# EAGLE design cm_ltc6102 (EAGLE 8.3.0)

## Sheet 1 of 2
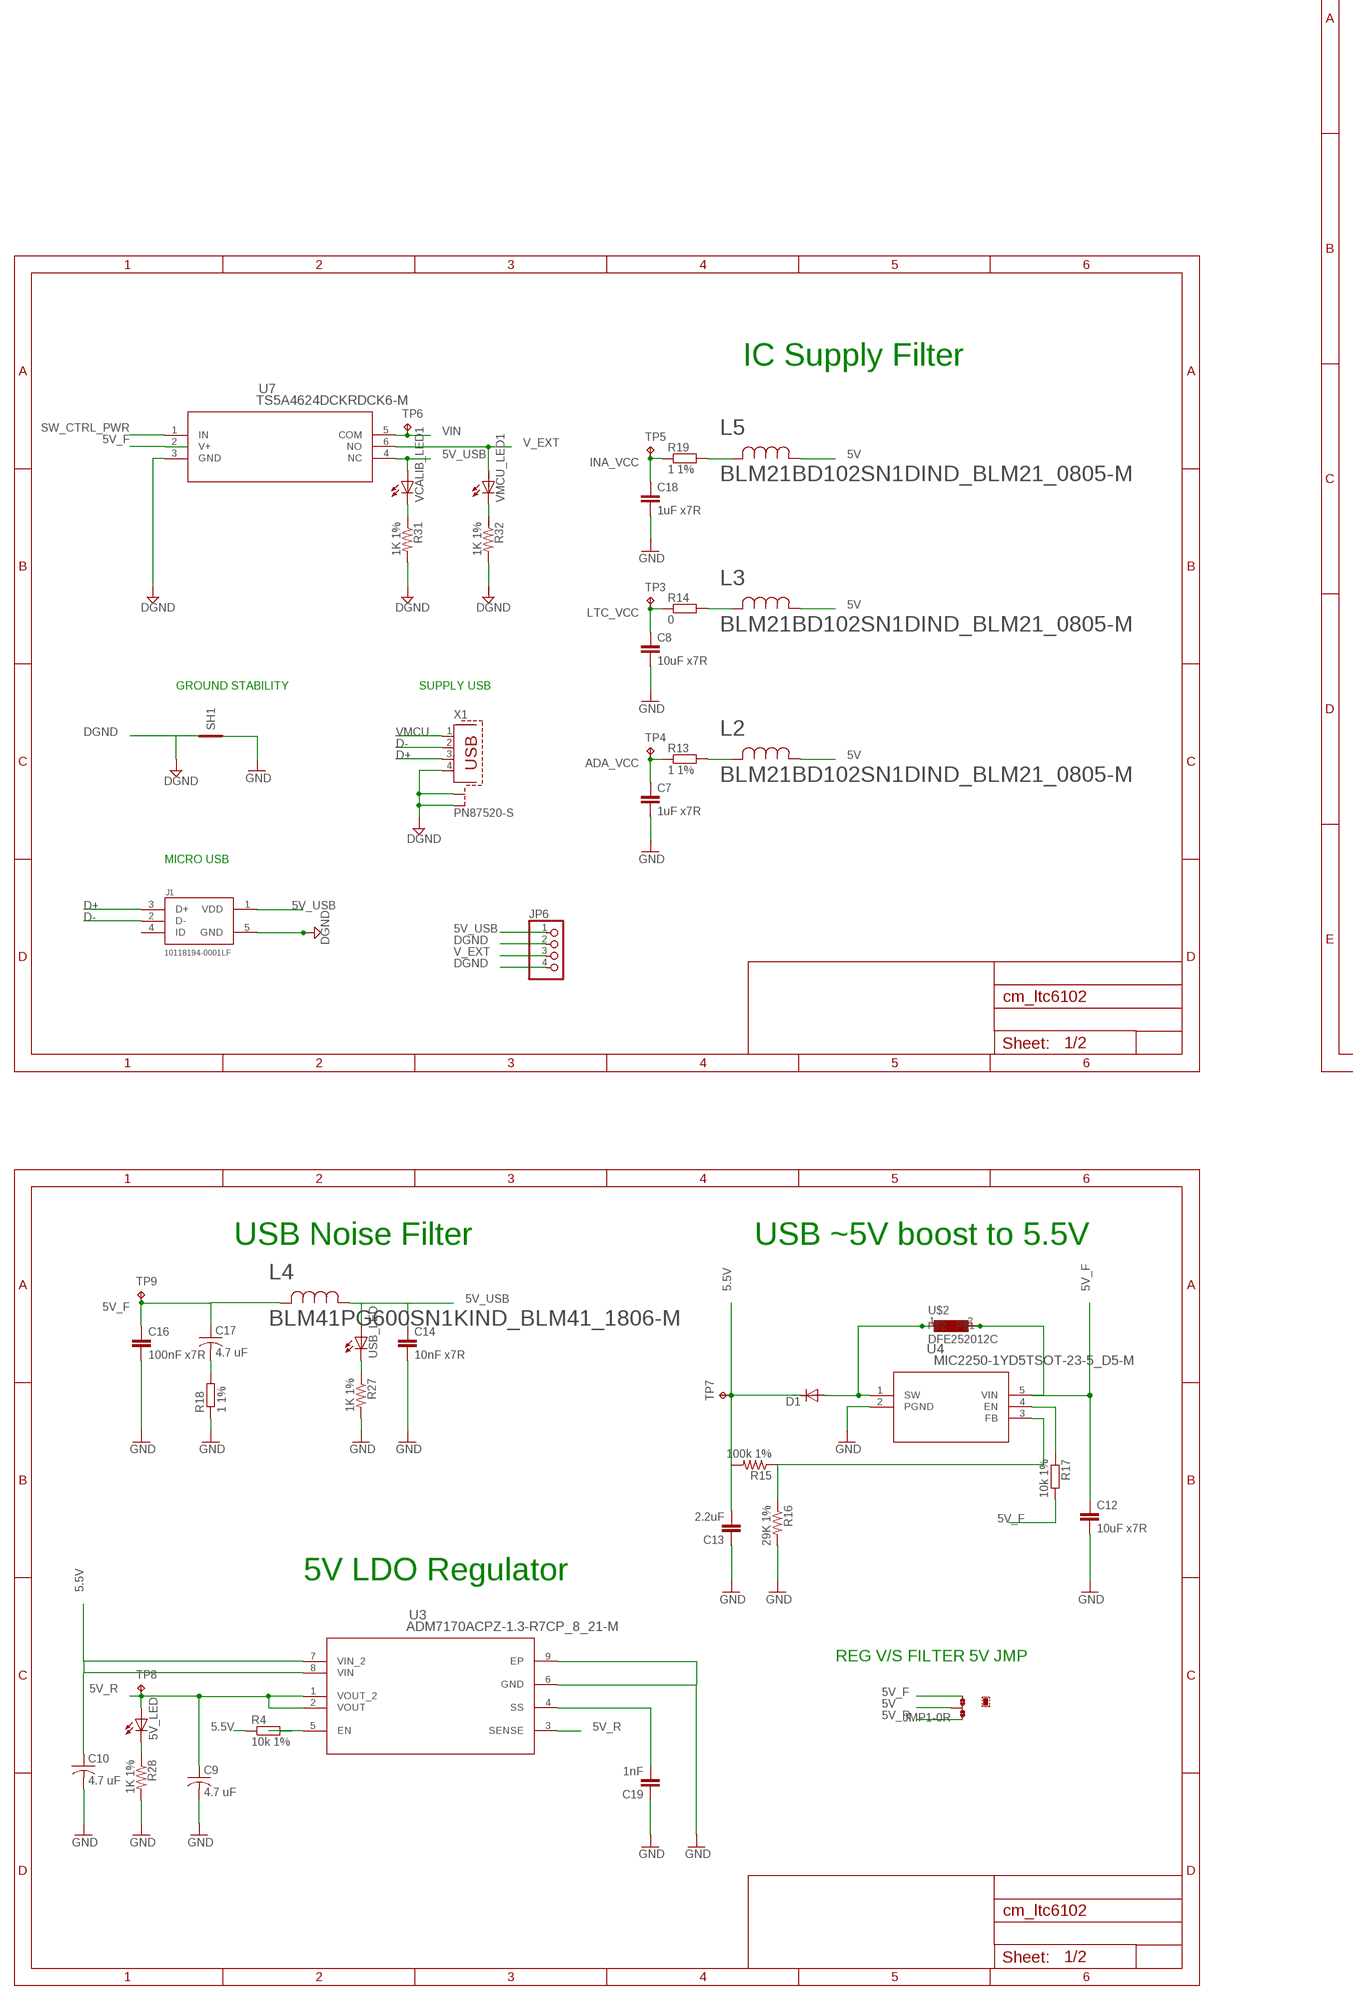
[diagram p0: schematic, sheet 1, part 1 of 2]
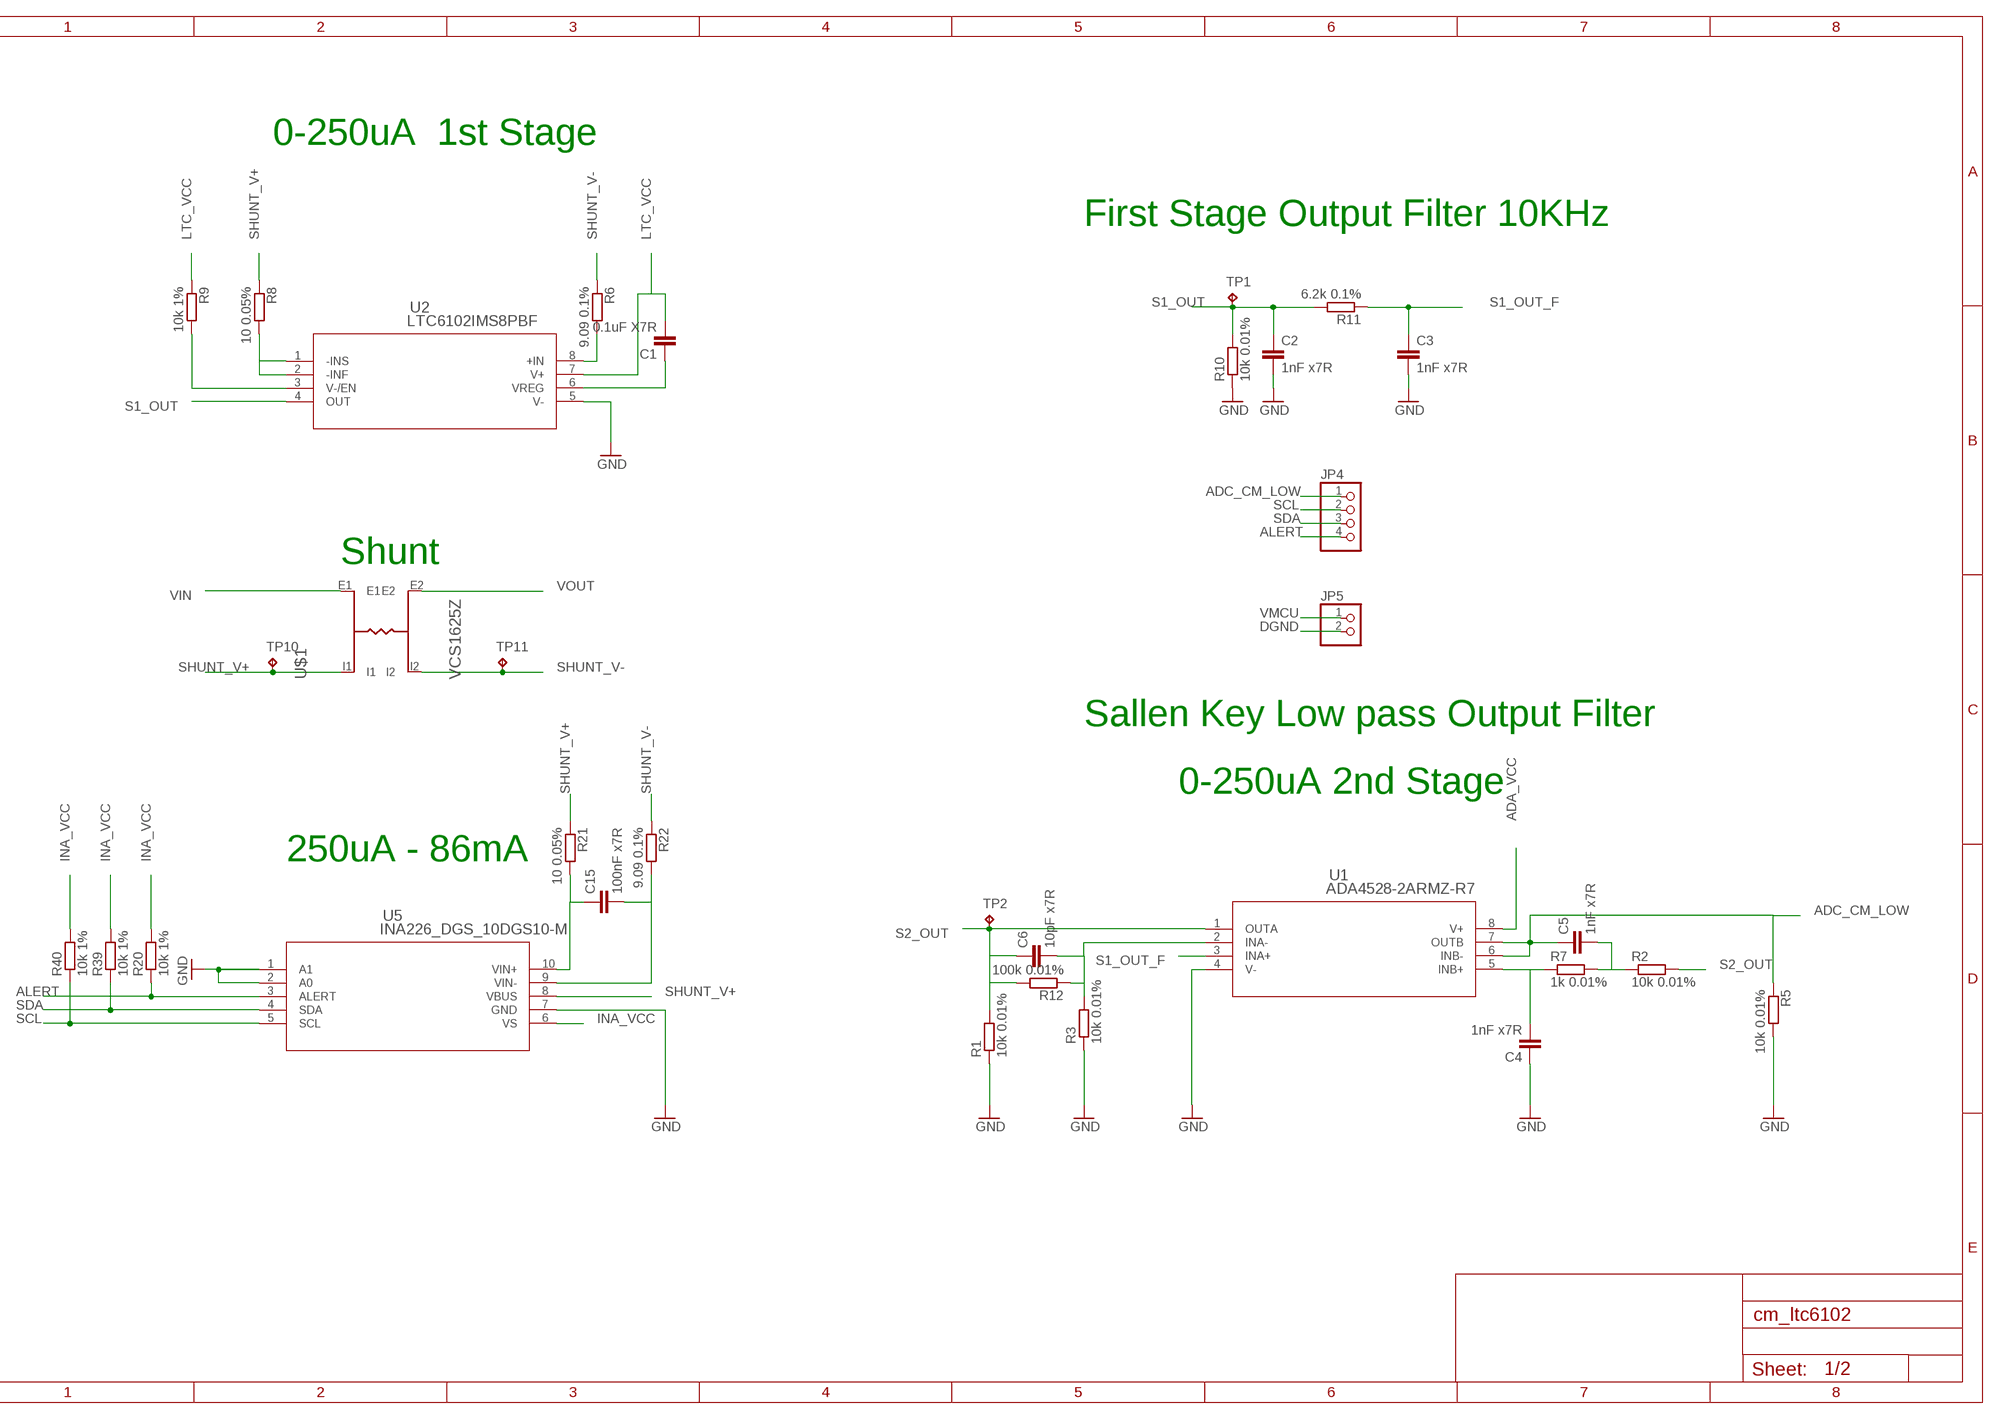
[diagram p1: schematic, sheet 1, part 2 of 2]

### Parts
5V_LED  LEDCHIPLED_0603  [CHIPLED_0603]
C1  0.1uF X7R  C-EUC0805  [C0805]
C2  1nF x7R  C-EUC0603  [C0603]
C3  1nF x7R  C-EUC0603  [C0603]
C4  1nF x7R  C-EUC0603  [C0603]
C5  1nF x7R  C-EUC0603  [C0603]
C6  10pF x7R  C-EUC0603  [C0603]
C7  1uF x7R  C-EUC0603  [C0603]
C8  10uF x7R  C-EUC0603  [C0603]
C9  4.7 uF  C-USC1206  [C1206]
C10  4.7 uF  C-USC1206  [C1206]
C12  10uF x7R  C-EUC0603  [C0603]
C13  2.2uF  C-EUC0603  [C0603]
C14  10nF x7R  C-EUC0603  [C0603]
C15  100nF x7R  C-EUC0603  [C0603]
C16  100nF x7R  C-EUC0603  [C0603]
C17  4.7 uF  C-USC1206  [C1206]
C18  1uF x7R  C-EUC0603  [C0603]
C19  1nF  C-EUC0603  [C0603]
D1  DIODE-SOD80C  [SOD80C]
J1  10118194-0001LF  [FRAMATOME_10118194-0001LF]
JMP1  0R-JUMPA  [A0R-JMP]
JP4  PINHD-1X4  [1X04]
JP5  PINHD-1X2  [1X02]
JP6  PINHD-1X4  [1X04]
L2  BLM21BD102SN1DIND_BLM21_0805-M  [IND_BLM21_0805-M]
L3  BLM21BD102SN1DIND_BLM21_0805-M  [IND_BLM21_0805-M]
L4  BLM41PG600SN1KIND_BLM41_1806-M  [IND_BLM41_1806-M]
L5  BLM21BD102SN1DIND_BLM21_0805-M  [IND_BLM21_0805-M]
R1  10k 0.01%  R-EU_R0603  [R0603]
R2  10k 0.01%  R-EU_R0603  [R0603]
R3  10k 0.01%  R-EU_R0603  [R0603]
R4  10k 1%  R-EU_R0603  [R0603]
R5  10k 0.01%  R-EU_R0603  [R0603]
R6  9.09 0.1%  R-EU_R0603  [R0603]
R7  1k 0.01%  R-EU_R0805  [R0805]
R8  10 0.05%  R-EU_R0603  [R0603]
R9  10k 1%  R-EU_R0603  [R0603]
R10  10k 0.01%  R-EU_R0603  [R0603]
R11  6.2k 0.1%  R-EU_R0603  [R0603]
R12  100k 0.01%  R-EU_R0603  [R0603]
R13  1 1%  R-EU_R0603  [R0603]
R14  0  R-EU_R0603  [R0603]
R15  100k 1%  R-US_R0603  [R0603]
R16  29K 1%  R-US_R0603  [R0603]
R17  10k 1%  R-EU_R0603  [R0603]
R18  1 1%  R-EU_R0603  [R0603]
R19  1 1%  R-EU_R0603  [R0603]
R20  10k 1%  R-EU_R0603  [R0603]
R21  10 0.05%  R-EU_R0603  [R0603]
R22  9.09 0.1%  R-EU_R0603  [R0603]
R27  1K 1%  R-US_R0603  [R0603]
R28  1K 1%  R-US_R0603  [R0603]
R31  1K 1%  R-US_R0603  [R0603]
R32  1K 1%  R-US_R0603  [R0603]
R39  10k 1%  R-EU_R0603  [R0603]
R40  10k 1%  R-EU_R0603  [R0603]
SH1  SHORT-VT5  [SHORT_TOP-50]
TP1  TPPAD1-13  [P1-13]
TP2  TPPAD1-13  [P1-13]
TP3  TPTP11R  [TP11R]
TP4  TPTP11R  [TP11R]
TP5  TPTP11R  [TP11R]
TP6  TPTP11R  [TP11R]
TP7  TPTP11R  [TP11R]
TP8  TPTP11R  [TP11R]
TP9  TPTP11R  [TP11R]
TP10  TPTP11R  [TP11R]
TP11  TPTP11R  [TP11R]
U1  ADA4528-2ARMZ-R7  [RM_8]
U2  LTC6102IMS8PBF  [MSOP-8_MS]
U3  ADM7170ACPZ-1.3-R7CP_8_21-M  [CP_8_21-M]
U4  MIC2250-1YD5TSOT-23-5_D5-M  [TSOT-23-5_D5-M]
U5  INA226_DGS_10DGS10-M  [DGS10-M]
U7  TS5A4624DCKRDCK6-M  [DCK6-M]
U$1  VCS1625Z  [VCS1625Z]
U$2  DFE252012C  [DFE252012C]
USB_LED  LEDCHIPLED_0603  [CHIPLED_0603]
VCALIB_LED1  LEDCHIPLED_0603  [CHIPLED_0603]
VMCU_LED1  LEDCHIPLED_0603  [CHIPLED_0603]
X1  PN87520-S  [PN87520-S]

### Nets
5.5V: C10.1 C13.2 D1.C R4.1 R15.2 TP7.TP U3.7(VIN_2) U3.8(VIN)
5V: JMP1.2 L2.1 L3.1 L5.1
5V_F: C12.1 C16.1 C17.1 JMP1.3 L4.2 R17.2 TP9.TP U4.5(VIN) U7.2(V+) U$2.2 ; also sheet 2
5V_R: 5V_LED.A C9.1 JMP1.1 TP8.TP U3.1(VOUT_2) U3.2(VOUT) U3.3(SENSE)
5V_USB: C14.1 J1.1(VDD) JP6.1 L4.1 U7.4(NC) USB_LED.A VCALIB_LED1.A
ADA_VCC: C7.1 R13.1 TP4.TP U1.8(V+)
ADC_CM_LOW: C5.1 JP4.1 R5.1 U1.6(INB-) U1.7(OUTB)
ALERT: JP4.4 R20.1 U5.3(ALERT)
D+: J1.3(D+) X1.3
D-: J1.2(D-) X1.2
DGND: J1.5(GND) JP5.2 JP6.2 JP6.4 R31.2 R32.2 SH1.2 U7.3(GND) X1.4 X1.S1 X1.S2 ; also sheet 2
GND: C2.2 C3.2 C4.1 C7.2 C8.2 C9.2 C10.2 C12.2 C13.1 C14.2 C16.2 C18.2 C19.1 R1.1 R3.1 R5.2 R10.1 R16.2 R18.1 R27.2 R28.2 SH1.1 U1.4(V-) U2.5(V-) U3.6(GND) U3.9(EP) U4.2(PGND) U5.1(A1) U5.2(A0) U5.7(GND)
INA_VCC: C18.1 R19.1 R20.2 R39.2 R40.2 TP5.TP U5.6(VS)
LTC_VCC: C1.2 C8.1 R9.1 R14.1 TP3.TP U2.7(V+)
N$1: R8.2 U2.1(-INS) U2.2(-INF)
N$2: R6.2 U2.8(+IN)
N$3: R27.1 USB_LED.C
N$5: R9.2 U2.3(V-/EN)
N$6: C1.1 U2.6(VREG)
N$7: C4.2 R7.1 U1.5(INB+)
N$8: C5.2 R2.1 R7.2
N$9: L3.2 R14.2
N$10: D1.A U4.1(SW) U$2.1
N$11: C6.2 R3.2 R12.1 U1.2(INA-)
N$12: L2.2 R13.2
N$13: C15.1 R21.2 U5.10(VIN+)
N$14: C19.2 U3.4(SS)
N$15: R4.2 U3.5(EN)
N$17: R15.1 R16.1 U4.3(FB)
N$18: R17.1 U4.4(EN)
N$19: C17.2 R18.2
N$20: L5.2 R19.2
N$21: C15.2 R22.2 U5.9(VIN-)
N$22: 5V_LED.C R28.1
N$25: R31.1 VCALIB_LED1.C
N$26: R32.1 VMCU_LED1.C
S1_OUT: C2.1 R10.2 R11.2 TP1.TP U2.4(OUT)
S1_OUT_F: C3.1 R11.1 U1.3(INA+)
S2_OUT: C6.1 R1.2 R2.2 R12.2 TP2.TP U1.1(OUTA)
SCL: JP4.2 R40.1 U5.5(SCL)
SDA: JP4.3 R39.1 U5.4(SDA)
SHUNT_V+: R8.1 R21.1 TP10.TP U5.8(VBUS) U$1.I1
SHUNT_V-: R6.1 R22.1 TP11.TP U$1.I2
SW_CTRL_PWR: U7.1(IN) ; also sheet 2
V_EXT: JP6.3 U7.6(NO) VMCU_LED1.A
VIN: TP6.TP U7.5(COM) U$1.E1
VMCU: JP5.1 X1.1 ; also sheet 2
VOUT: U$1.E2 ; also sheet 2
Unconnected: J1.4(ID)

### Notes on the sheet
- 0-250uA  1st Stage
- First Stage Output Filter 10KHz
- Shunt
- IC Supply Filter
- Sallen Key Low pass Output Filter
- 0-250uA 2nd Stage
- 250uA - 86mA
- GROUND STABILITY | SUPPLY USB
- MICRO USB
- USB Noise Filter | USB ~5V boost to 5.5V
- 5V LDO Regulator
- REG V/S FILTER 5V JMP

## Sheet 2 of 2
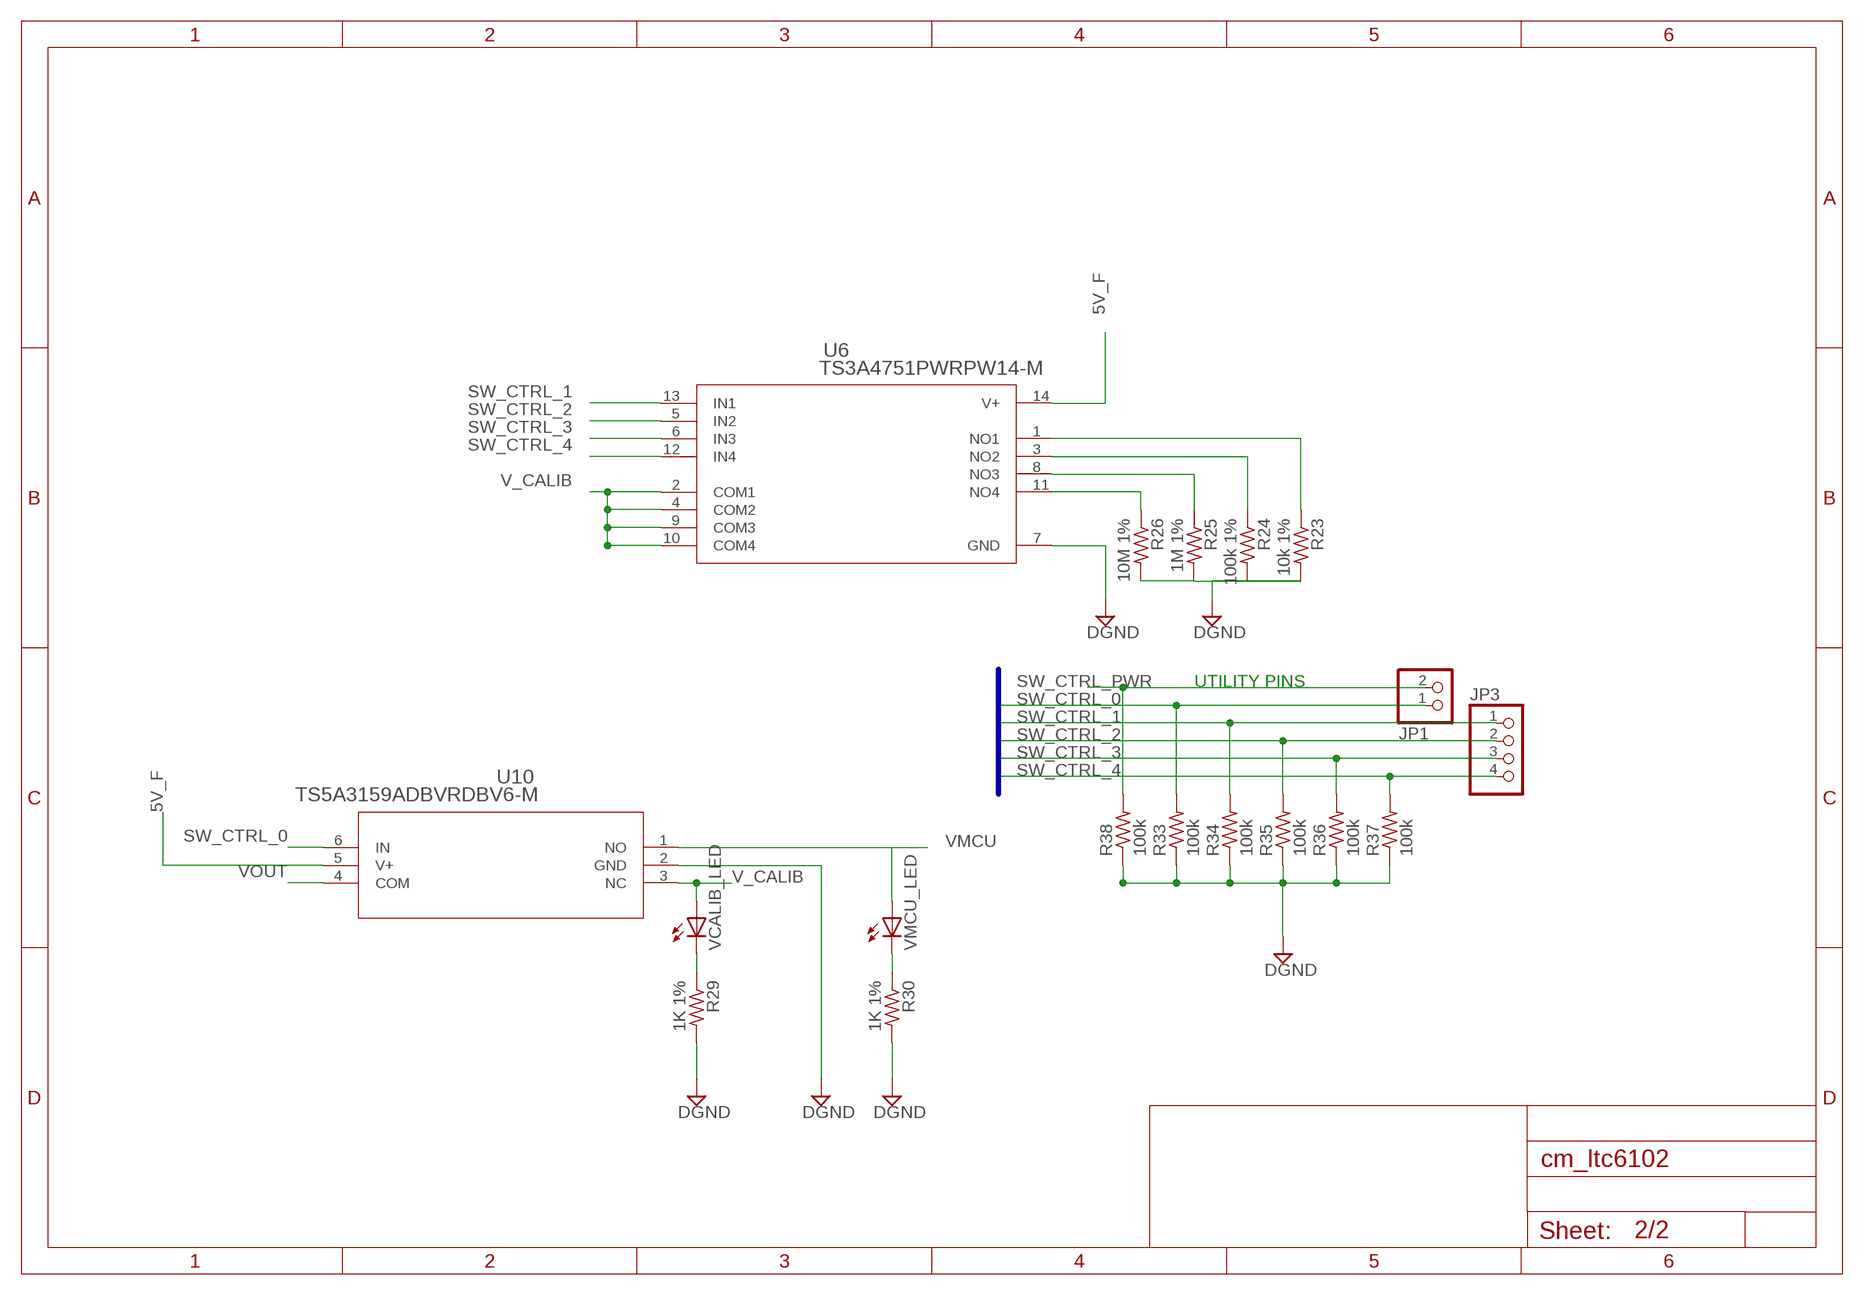
[diagram p2: schematic, sheet 2]

### Parts
JP1  PINHD-1X2  [1X02]
JP3  PINHD-1X4  [1X04]
R23  10k 1%  R-US_R0603  [R0603]
R24  100k 1%  R-US_R0603  [R0603]
R25  1M 1%  R-US_R0603  [R0603]
R26  10M 1%  R-US_R0603  [R0603]
R29  1K 1%  R-US_R0603  [R0603]
R30  1K 1%  R-US_R0603  [R0603]
R33  100k  R-US_R0805  [R0805]
R34  100k  R-US_R0805  [R0805]
R35  100k  R-US_R0805  [R0805]
R36  100k  R-US_R0805  [R0805]
R37  100k  R-US_R0805  [R0805]
R38  100k  R-US_R0805  [R0805]
U6  TS3A4751PWRPW14-M  [PW14-M]
U10  TS5A3159ADBVRDBV6-M  [DBV6-M]
VCALIB_LED  LEDCHIPLED_0603  [CHIPLED_0603]
VMCU_LED  LEDCHIPLED_0603  [CHIPLED_0603]

### Nets
5V_F: U6.14(V+) U10.5(V+) ; also sheet 1
DGND: R23.2 R24.2 R25.2 R26.2 R29.2 R30.2 R33.1 R34.1 R35.1 R36.1 R37.1 R38.1 U6.7(GND) U10.2(GND) ; also sheet 1
N$23: R29.1 VCALIB_LED.C
N$24: R30.1 VMCU_LED.C
N$30: R23.1 U6.1(NO1)
N$31: R24.1 U6.3(NO2)
N$32: R25.1 U6.8(NO3)
N$33: R26.1 U6.11(NO4)
SW_CTRL_0: JP1.1 R33.2 U10.6(IN)
SW_CTRL_1: JP3.1 R34.2 U6.13(IN1)
SW_CTRL_2: JP3.2 R35.2 U6.5(IN2)
SW_CTRL_3: JP3.3 R36.2 U6.6(IN3)
SW_CTRL_4: JP3.4 R37.2 U6.12(IN4)
SW_CTRL_PWR: JP1.2 R38.2 ; also sheet 1
V_CALIB: U6.2(COM1) U6.4(COM2) U6.9(COM3) U6.10(COM4) U10.3(NC) VCALIB_LED.A
VMCU: U10.1(NO) VMCU_LED.A ; also sheet 1
VOUT: U10.4(COM) ; also sheet 1

### Buses
SWITCH_CTRL_[1..6]

### Notes on the sheet
- UTILITY PINS

## Library data of the parts
5V_LED USB_LED VCALIB_LED VCALIB_LED1 VMCU_LED VMCU_LED1 = led:LED: LED OSRAM: - CHIPLED LG R971, LG N971, LY N971, LG Q971, LY Q971, LO R971, LY R971 LH N974, LH R974 LS Q976, LO Q976, LY Q976 LO Q996 - Hyper CHIPLED LW Q18S LB Q993, LB Q99A, LB R99A - SideLED LS A670, LO A670, LY A670, LG A670, LP A670 LB A673, LV A673, LT A673, LW A673 LH A674 LY A675 LS A676, LA A676, LO A676, LY A676, LW A676 LS A679, LY A679, LG A679 - Hyper Micro SIDELED® LS Y876, LA Y876, LO Y876, LY Y876 LT Y87S - SmartLED LW L88C, LW L88S LB L89C, LB L89S, LG L890 LS L89K, LO L89K, LY L89K LS L896, LA L896, LO L896, LY L896 - TOPLED LS T670, LO T670, LY T670, LG T670, LP T670 LSG T670, LSP T670, LSY T670, LOP T670, LYG T670 LG T671, LOG T671, LSG T671 LB T673, LV T673, LT T673, LW T673 LH T674 LS T676, LA T676, LO T676, LY T676, LB T676, LH T676, LSB T676, LW T676 LB T67C, LV T67C, LT T67C, LS T67K, LO T67K, LY T67K, LW E67C LS E67B, LA E67B, LO E67B, LY E67B, LB E67C, LV E67C, LT E67C LW T67C LS T679, LY T679, LG T679 LS T770, LO T770, LY T770, LG T770, LP T770 LB T773, LV T773, LT T773, LW T773 LH T774 LS E675, LA E675, LY E675, LS T675 LS T776, LA T776, LO T776, LY T776, LB T776 LHGB T686 LT T68C, LB T68C - Hyper Mini TOPLED® LB M676 - Mini TOPLED Santana® LG M470 LS M47K, LO M47K, LY M47K Source: http://www.osram.convergy.de LUXEON: - LUMILED® LXK2-PW12-R00, LXK2-PW12-S00, LXK2-PW14-U00, LXK2-PW14-V00 LXK2-PM12-R00, LXK2-PM12-S00, LXK2-PM14-U00 LXK2-PE12-Q00, LXK2-PE12-R00, LXK2-PE12-S00, LXK2-PE14-T00, LXK2-PE14-U00 LXK2-PB12-K00, LXK2-PB12-L00, LXK2-PB12-M00, LXK2-PB14-N00, LXK2-PB14-P00, LXK2-PB14-Q00 LXK2-PR12-L00, LXK2-PR12-M00, LXK2-PR14-Q00, LXK2-PR14-R00 LXK2-PD12-Q00, LXK2-PD12-R00, LXK2-PD12-S00 LXK2-PH12-R00, LXK2-PH12-S00 LXK2-PL12-P00, LXK2-PL12-Q00, LXK2-PL12-R00 Source: www.luxeon.com KINGBRIGHT: KA-3528ASYC Source: www.kingbright.com
C1-C8 C12-C16 C18 C19 = rcl:C-EU: CAPACITOR, European symbol
C9 C10 C17 = rcl:C-US: CAPACITOR, American symbol
D1 = diode:DIODE-: DIODE
J1 = 10118194-0001LF:10118194-0001LF: Conn Micro USB Type B RCP 5 POS 0.65mm Solder RA SMD 5 Terminal 1 Port T/R; AVAILABILITY: Good; DESCRIPTION: Conn Micro USB Type B RCP 5 POS 0.65mm Solder RA SMD 5 Terminal 1 Port T/R; MF: Amphenol; MP: 10118194-0001LF; PACKAGE: DIP-4 FCI; PRICE: 0.24 USD
JMP1 = jump-0r-smd:0R-JUMP: SMD 0R 0805 Jumper
JP1 JP5 = pinhead:PINHD-1X2: PIN HEADER
JP3 JP4 JP6 = pinhead:PINHD-1X4: PIN HEADER
L2 L3 L5 = ferrite_bead:BLM21BD102SN1D; MANUFACTURER_PART_NUMBER: BLM21BD102SN1D; VENDOR: MURATA
L4 = ferrite_bead:BLM41PG600SN1K; MANUFACTURER_PART_NUMBER: BLM41PG600SN1K; VENDOR: MURATA
R1-R14 R17-R22 R39 R40 = resistor:R-EU_: RESISTOR, European symbol
R15 R16 R23-R32 = rcl:R-US_: RESISTOR, American symbol
R33-R38 = resistor:R-US_: RESISTOR, American symbol
SH1 = shorts-old:SHORT-V: Short between two nets; BOM: no
TP1-TP11 = testpad:TP: Test pad
U1 = analog_devices:ADA4528-2ARMZ-R7; MANUFACTURER_PART_NUMBER: ADA45282ARMZR7; VENDOR: Analog Devices Inc
U2 = linear_technology:LTC6102IMS8PBF; MANUFACTURER_PART_NUMBER: LTC6102IMS8#PBF; VENDOR: Linear Technology
U3 = analog_devices:ADM7170ACPZ-1.3-R7; MANUFACTURER_PART_NUMBER: ADM7170ACPZ1.3R7; VENDOR: Analog Devices Inc
U4 = texas_instruments:MIC2250-1YD5; MANUFACTURER_PART_NUMBER: MIC22501YD5; VENDOR: Micrel
U5 = texas_instruments:INA226_DGS_10; MANUFACTURER_PART_NUMBER: INA226_DGS_10; VENDOR: Texas Instruments
U6 = texas_instruments:TS3A4751PWR; MANUFACTURER_PART_NUMBER: TS3A4751PWR; VENDOR: Texas Instruments
U7 = texas_instruments:TS5A4624DCKR; MANUFACTURER_PART_NUMBER: TS5A4624DCKR; VENDOR: Texas Instruments
U10 = texas_instruments:TS5A3159ADBVR; MANUFACTURER_PART_NUMBER: TS5A3159ADBVR; VENDOR: Texas Instruments
U$1 = vishay:VCS1625Z
U$2 = DFE252012C:DFE252012C
X1 = con-berg:PN87520-S; OC_FARNELL: unknown; OC_NEWARK: unknown

## Board
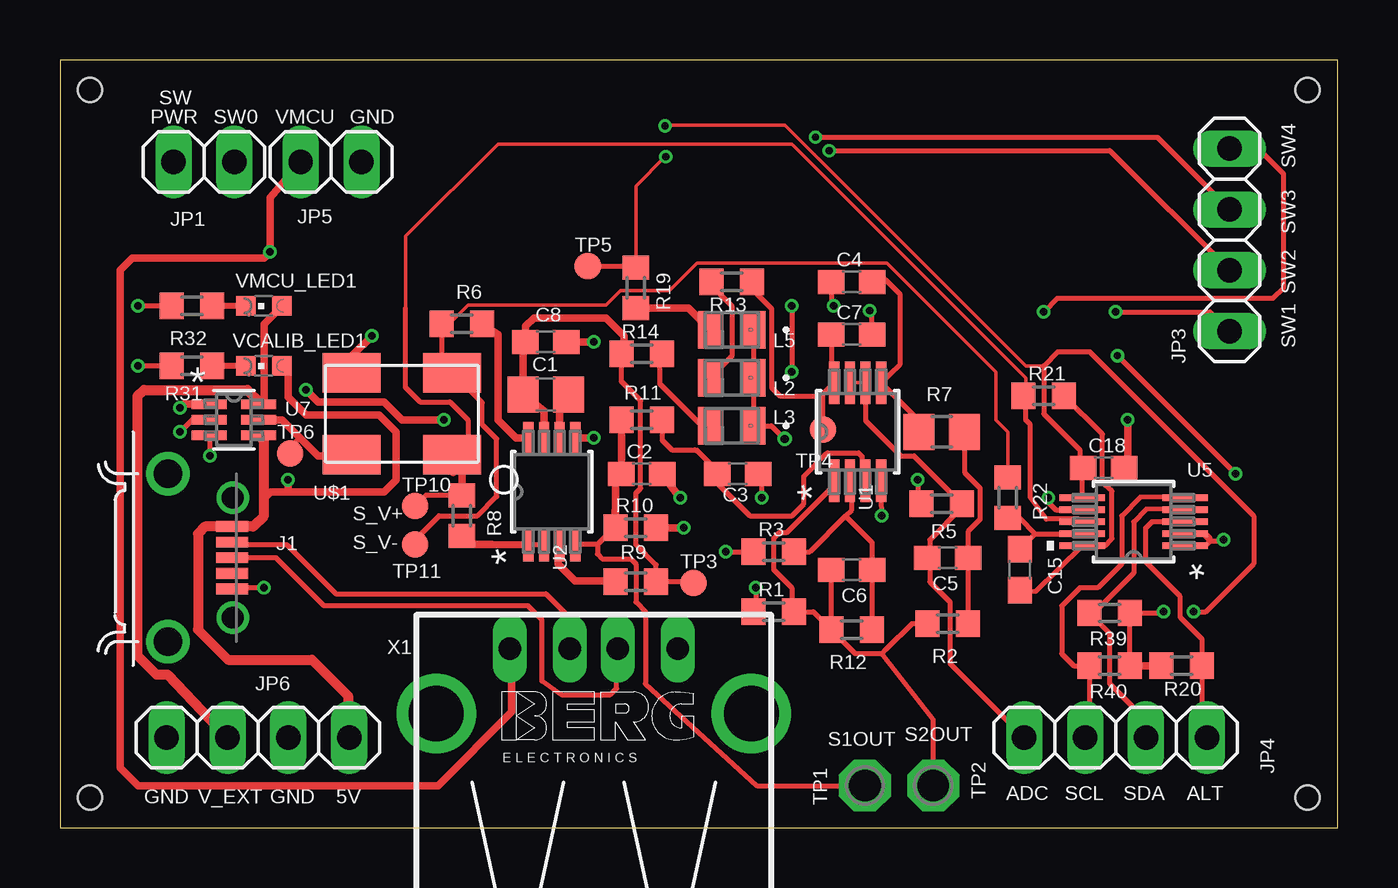
[diagram p3: board, top side]
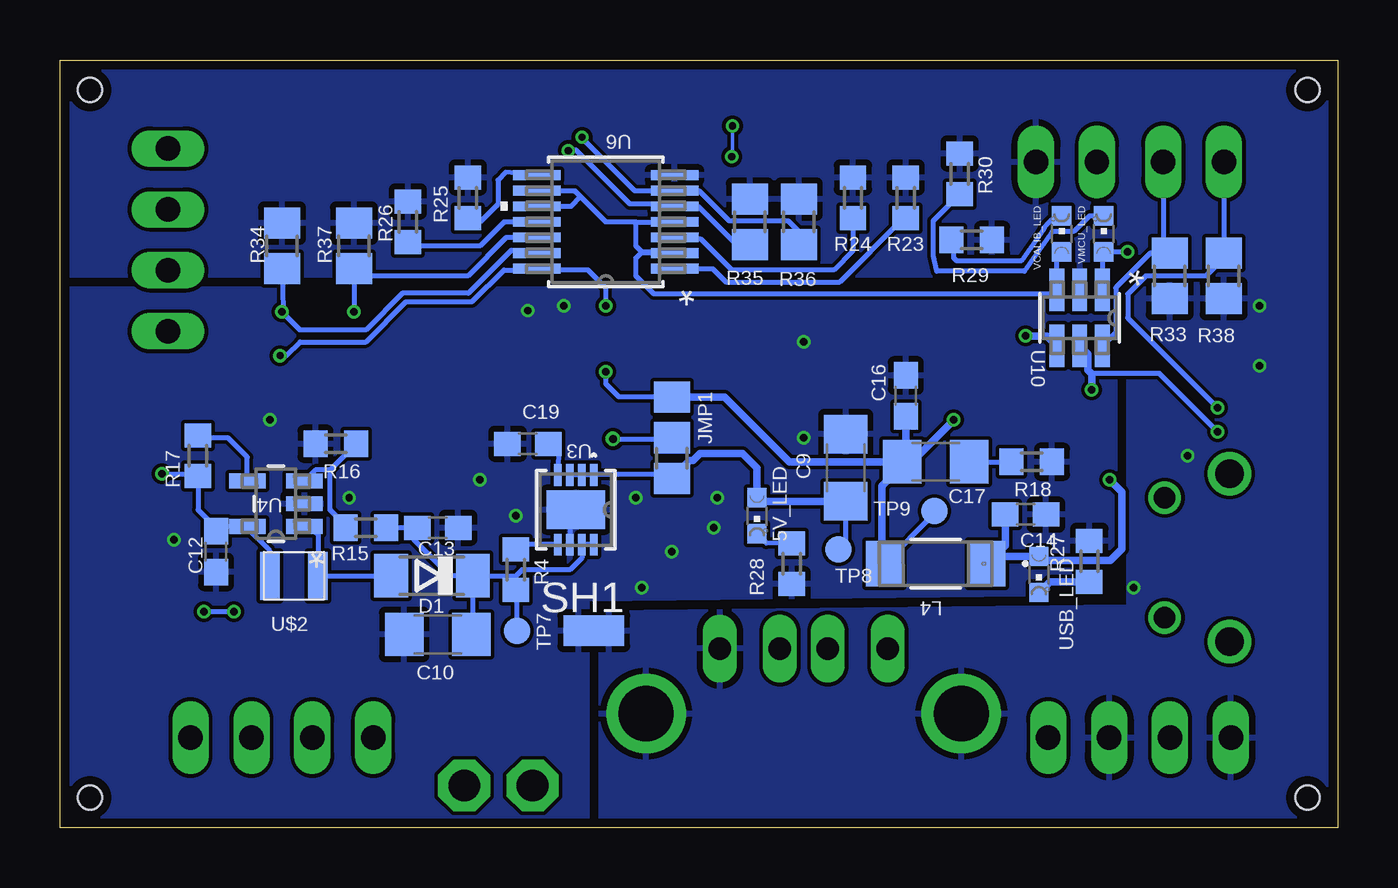
[diagram p4: board, bottom side, seen from below]

Size 53.25 x 32 mm. Coordinates in mm from the lower left corner, seen from the top.
Outline: 0,0 53.25,0 53.25,32 0,32 0,0
Copper layers (1*16): Top 0.035559375mm / dielectric 1.6mm / Bottom 0.035559375mm
Design rules "oshpark-2layer (1)": minimum track width 6mil, minimum drill 10mil, track to track 6mil, track to pad 6mil, pad to pad 6mil, via to via 6mil, smd to smd 6mil, copper to edge 15mil, drill to drill 6mil, minimum pad ring 5mil, minimum via ring 5mil, stop-mask expansion 2.5mil, vias tented up to drill 0mil, thermal gap 10mil
Holes 1 mm at 1.25,30.75 52,30.75 52,1.25 1.25,1.25

### Footprints (pad centres in the part's own frame; a part is rotated, then mirrored left to right if it is on the bottom)
CHIPLED_0603 = smd 0.8 x 0.8: A 0,-0.75; C 0,0.75
C0805 = smd 1.3 x 1.5: 1 -0.95,0; 2 0.95,0
C0603 = smd 1.1 x 1: 1 -0.85,0; 2 0.85,0
C1206 = smd 1.6 x 1.8: 1 -1.4,0; 2 1.4,0
SOD80C = smd 1.4 x 1.8: A 1.7,0; C -1.7,0
FRAMATOME_10118194-0001LF = smd 0.45 x 1.35: 1 -1.3,2.675; 2 -0.65,2.675; 3 0,2.675; 4 0.65,2.675; 5 1.3,2.675 | drill 0.9: P$6 -2.5,2.7; P$7 2.5,2.7 | drill 1.2: P$8 -3.5,0; P$9 3.5,0
A0R-JMP = smd 1.5 x 1.3: 1 0,1.7; 2 0,0; 3 0,-1.7
1X02 = drill 1.016 long: 1 -1.27,0; 2 1.27,0
1X04 = drill 1.016 long: 1 -3.81,0; 2 -1.27,0; 3 1.27,0; 4 3.81,0
IND_BLM21_0805-M = smd 1.016 x 1.549: 1 -0.902,0; 2 0.902,0
IND_BLM41_1806-M = smd 1.549 x 1.905: 1 -2.134,0; 2 2.134,0
R0603 = smd 1 x 1.1: 1 -0.85,0; 2 0.85,0
R0805 = smd 1.3 x 1.5: 1 -0.95,0; 2 0.95,0
SHORT_TOP-50 = smd 1.27 x 1.27: 1 0.635,0; 2 -0.635,0
P1-13 = drill 1.321 pad 2.159 octagon: TP 0,0
TP11R = smd 1.1 x 1.1: TP 0,0
RM_8 = smd 1.778 x 0.432: 1 -2.045,0.975; 2 -2.045,0.325; 3 -2.045,-0.325; 4 -2.045,-0.975; 5 2.045,-0.975; 6 2.045,-0.325; 7 2.045,0.325; 8 2.045,0.975
MSOP-8_MS = smd 1.397 x 0.432: 1 -2.21,0.975; 2 -2.21,0.325; 3 -2.21,-0.325; 4 -2.21,-0.975; 5 2.21,-0.975; 6 2.21,-0.325; 7 2.21,0.325; 8 2.21,0.975
CP_8_21-M = smd 0.906 x 0.3: 1 -1.453,0.75; 2 -1.453,0.25; 3 -1.453,-0.25; 4 -1.453,-0.75; 5 1.453,-0.75; 6 1.453,-0.25; 7 1.453,0.25; 8 1.453,0.75 | smd 1.6 x 2.44: 9 0,0
TSOT-23-5_D5-M = smd 1.524 x 0.61: 1 -1.194,0.95; 2 -1.194,0; 3 -1.194,-0.95; 4 1.194,-0.95; 5 1.194,0.95
DGS10-M = smd 1.88 x 0.279: 1 -2.146,1; 2 -2.146,0.5; 3 -2.146,0; 4 -2.146,-0.5; 5 -2.146,-1; 6 2.146,-1; 7 2.146,-0.5; 8 2.146,0; 9 2.146,0.5; 10 2.146,1
PW14-M = smd 1.981 x 0.406: 1 -2.87,1.95; 2 -2.87,1.3; 3 -2.87,0.65; 4 -2.87,0; 5 -2.87,-0.65; 6 -2.87,-1.3; 7 -2.87,-1.95; 8 2.87,-1.95; 9 2.87,-1.3; 10 2.87,-0.65; 11 2.87,0; 12 2.87,0.65; 13 2.87,1.3; 14 2.87,1.95
DCK6-M = smd 1.473 x 0.406: 1 -1.029,0.65; 2 -1.029,0; 3 -1.029,-0.65; 4 1.029,-0.65; 5 1.029,0; 6 1.029,0.65
DBV6-M = smd 1.778 x 0.61: 1 -1.168,0.95; 2 -1.168,0; 3 -1.168,-0.95; 4 1.168,-0.95; 5 1.168,0; 6 1.168,0.95
VCS1625Z = smd 2.41 x 1.65: E1 2.095,1.715; E2 2.095,-1.715; I1 -2.095,1.715; I2 -2.095,-1.715
DFE252012C = smd 0.8 x 2: 1 -1,0; 2 1,0
PN87520-S = drill 0.95 long: 1 -3.5,2.71; 2 -1,2.71; 3 1,2.71; 4 3.5,2.71 | drill 2.3 pad 2.9: S1 -6.57,0; S2 6.57,0

### Placement (x,y rotation side)
5V_LED  24.2,13 180 bottom
C1  20.25,18.05 180 top
C2  24.25,14.75 0 top
C3  28.25,14.75 0 top
C4  33,22.75 0 top
C5  37,11.25 0 top
C6  33,10.75 0 top
C7  33,20.55 0 top
C8  20.25,20.25 0 top
C9  20.5,15 90 bottom
C10  37.5,8.05 180 bottom
C12  46.75,11.5 270 bottom
C13  37.5,12.5 180 bottom
C14  13,13.05 0 bottom
C15  40,10.75 90 top
C16  18,18 90 bottom
C17  16.75,15.25 0 bottom
C18  43.5,15 0 top
C19  33.75,16 0 bottom
D1  37.75,10.5 180 bottom
J1  4.5,11.25 270 top
JMP1  27.75,16.25 180 bottom
JP1  6,27.75 180 top
JP3  48.75,24.5 90 top
JP4  44,3.75 0 top
JP5  11.3,27.75 0 top
JP6  8.25,3.75 180 top
L2  28,18.75 180 top
L3  28,16.75 180 top
L4  16.75,11 180 bottom
L5  28,20.75 180 top
R1  29.75,9 0 top
R2  37,8.5 180 top
R3  29.75,11.5 0 top
R4  34.25,10.75 90 bottom
R5  36.75,13.5 180 top
R6  16.75,21 0 top
R7  36.75,16.5 0 top
R8  16.75,13 270 top
R9  24,10.25 180 top
R10  24,12.5 180 top
R11  24.25,17 180 top
R12  33,8.25 180 top
R13  28,22.75 180 top
R14  24.25,19.75 0 top
R15  40.5,12.5 0 bottom
R16  41.75,16 180 bottom
R17  47.5,15.5 270 bottom
R18  12.75,15.25 180 bottom
R19  24,22.5 270 top
R20  46.75,6.75 180 top
R21  41,18 0 top
R22  39.5,13.75 270 top
R23  18,26.25 90 bottom
R24  20.2,26.25 90 bottom
R25  36.25,26.25 90 bottom
R26  38.75,25.25 90 bottom
R27  10.35,11.1 90 bottom
R28  22.75,11 270 bottom
R29  15.25,24.5 0 bottom
R30  15.75,27.25 90 bottom
R31  5.5,19.25 180 top
R32  5.5,21.75 180 top
R33  7,23 90 bottom
R34  44,24.25 270 bottom
R35  24.5,25.25 270 bottom
R36  22.45,25.25 270 bottom
R37  41,24.25 270 bottom
R38  4.75,23 90 bottom
R39  43.75,8.95 0 top
R40  43.75,6.75 0 top
SH1  31,8.2 180 bottom
TP1  33.55,1.75 0 top
TP2  36.4,1.75 0 top
TP3  26.4,10.2 0 top
TP4  31.8,16.6 0 top
TP5  22,23.4 0 top
TP6  9.6,15.6 0 top
TP7  34.2,8.2 0 bottom
TP8  20.8,11.6 0 bottom
TP9  16.8,13.2 0 bottom
TP10  14.8,13.4 0 top
TP11  14.8,11.8 0 top
U1  33.25,16.5 90 top
U2  20.5,14 90 top
U3  31.75,13.25 270 bottom
U4  44.25,13.5 180 bottom
U5  44.75,12.75 180 top
U6  30.5,25.25 180 bottom
U7  7.25,17 0 top
U10  10.75,21.25 270 bottom
U$1  14.25,17.25 180 top
U$2  43.5,10.5 180 bottom
USB_LED  12.45,10.55 180 bottom
VCALIB_LED  11.5,24.75 0 bottom
VCALIB_LED1  8.5,19.25 90 top
VMCU_LED  9.75,24.75 0 bottom
VMCU_LED1  8.5,21.75 90 top
X1  22.25,4.75 0 top

### Tracks (layer width: path | path; a pad name or v marks a point on that pad's centre or on a via)
5.5V
  Bottom 0.2: 36.05,10.8 D1.C | 38.75,12.65 C13.2 | C13.2 38.5,12.65 38.5,12 37,10.5 D1.C | C13.2 R15.2 | U3.8 U3.7 31.5,11.25 32,10.75 34,10.75 34.25,10.5 | 34.25,10.5 34.25,10.01 R4.1 | D1.C 34.25,10.5 | D1.C 36.05,8.1 C10.1
  Bottom 0.203: TP7.TP 34.2,9.96 34.25,10.01
5V  (via drill 0.35)
  Top 0.2: L5.1 L2.1 L3.1 29.65,16.75 v30.2,16.2
  Bottom 0.2: v30.2,16.2 27.8,16.2 JMP1.2
5V_F  (via drill 0.3)
  Top 0.2: v49,14.75 v44.08,19.67 44,19.75 | v30.5,21.75 v30.5,19 | U7.2 5.5,17 v5,16.5
  Top 0.305: v16,17 14.25,17 13.5,17.75 10.75,17.75 v10.25,18.25
  Bottom 0.2: 45.53,12.55 U4.5 | 45.53,12.55 46.55,12.55 C12.1 46.75,12.5 47.5,13.25 47.5,14.62 | U$2.2 44.5,11.52 45.53,12.55 | 47.5,14.62 R17.2 | v49,14.75 47.62,14.75 47.5,14.62 | v30.5,19 30.5,18.5 29.95,17.95 JMP1.3 | U10.5 10.63,19.97 10.36,19.69 10.36,19.09 10.21,18.94 7.44,18.94 v5,16.5 | v44.08,19.67 43.83,19.67 43.25,20.25 40.5,20.25 38.83,21.93 36.08,21.93 34.75,23.25 33.42,23.25 U6.14 33.32,23.25 31.25,23.25 30.5,22.5 v30.5,21.75
  Bottom 0.203: TP9.TP 16.8,13.08 L4.2
  Bottom 0.305: C17.1 17.75,15.25 v16,17 | v10.25,18.25 10.25,18.91 10.41,19.07 10.41,19.74 10.63,19.97 | 18.4,15 C17.1 | C16.1 18,15.4 C17.1 | C17.1 18.15,15.1 19,14.25 19,11.12 L4.2 | C17.1 22.85,15.25 25.55,17.95 JMP1.3
5V_R
  Bottom 0.2: 31.5,14.75 U3.2 | U3.2 U3.1 30.95,14.75 27.95,14.75 JMP1.1 | U3.2 U3.3
  Bottom 0.203: C9.1 20.5,11.9 TP8.TP
  Bottom 0.305: C9.1 24.05,13.6 5V_LED.A 24.2,15 24.8,15.6 26.57,15.6 26.87,15.29 27,15.29 JMP1.1
5V_USB  (via drill 0.3)
  Top 0.305: 9.56,14 13.5,14 14,14.5 14,16.5 13.3,17.2 10.25,17.2 9.5,17.95 9.5,19 VCALIB_LED1.A | 9.56,14 8.78,14 8.5,13.72 | v9.5,14.5 9.5,14.06 9.56,14
  Top 0.406: U7.4 8.5,16.13 8.5,13.72 8.5,13 8.05,12.55 J1.1 6.05,12.55 5.75,12.25 5.75,8.28 5.76,8.27 5.76,8.24 7,7 10.5,7 12,5.5 12,3.81 JP6.1
  Bottom 0.305: L4.1 14.37,10.75 | L4.1 13.85,11.77 C14.1 | L4.1 14.32,11.3 USB_LED.A 12.1,11.14 9.47,11.14 9,11.62 9,14 v9.5,14.5
ADA_VCC
  Top 0.2: C7.1 32.15,18.67 U1.8 31.89,18.16 | 28.85,22.65 R13.1 28.85,22.44 29.66,21.63 29.66,18.34 30,18 31.73,18 31.89,18.16 | TP4.TP 31.8,18.07 31.89,18.16
ADC_CM_LOW
  Top 0.152: U1.7 U1.6
  Top 0.2: U1.6 33.58,16.97 35.05,15.5 35.6,15.5 R5.1 37.6,13.35 36.25,12 36.25,11.15 | 36.25,11.15 36.25,10.25 37.1,9.4 37.1,6.84 JP4.1 | 36.25,11.15 C5.1
ALERT
  Top 0.2: U5.3 45.5,12.75 45.25,12.5 45.25,11.08 46.69,9.63 46.69,8.77 47.6,7.86 R20.1 47.6,3.96 JP4.4
D+
  Top 0.2: J1.3 9,11.25 11,9.25 19.5,9.25 20.09,8.66 20.09,6.11 20.91,5.54 22.94,5.54 23.2,5.8 23.2,7.41 X1.3
D-
  Top 0.2: J1.2 7.29,11.79 9.46,11.79 11.5,9.75 20.25,9.75 21.25,8.75 X1.2
DGND  (via drill 0.3)
  Top 0.2: 6.3,16.25 U7.3 6.25,16.32 v6.25,15.5 | R32.2 v3.25,21.75 | R31.2 v3.25,19.25
  Top 0.203: v8.5,10 7.22,10 J1.5
  pour Bottom: 30.75,9 30.75,0.25 0.25,0.25 0.25,32 53.5,32 53.5,23 8.75,23 8.75,9.25
GND  (via drill 0.3)
  Top 0.2: U1.4 34.27,13.02 v34.25,13 | C4.1 32.15,21.85 v32.25,21.75 | v35.75,14.5 35.75,13.65 R5.2 | v27.75,11.5 R3.1 | U5.1 47.78,11.78 47.94,11.94 | 47.94,11.94 47.94,12.06 47.75,12.25 | U5.2 47.61,12.28 47.94,11.94 | 47.94,11.94 48.44,11.94 v48.5,12 | U5.7 41.5,13.25 41.2,13.55 v41.2,13.75 | v29,10 29,9.1 R1.1 | v29.25,13.75 29.25,14.6 C3.2
  Top 0.203: C7.2 33.85,21.45 v33.75,21.55
  Top 0.305: v22.25,16.25 21.43,16.25 U2.5 | v26,12.5 R10.1 | v25.85,13.75 C2.2 | v22.25,20.25 C8.2 | v44.5,17 44.5,15.15 C18.2
  Bottom 0.2: U3.6 31.95,12.9 U3.9 | R28.2 22.6,10.25
  pour Bottom: 31.25,0.25 31.25,9.5 9.25,9.75 9.25,22.5 53.5,22.5 53.5,0.25
INA_VCC  (via drill 0.3)
  Top 0.152: v25.25,27.97 25.22,27.97 24,26.75 R19.1 | 41,19.25 40.25,19.25 30.22,29.28 25.25,29.28 v25.22,29.25
  Top 0.2: U5.6 42.59,14.94 C18.1 42.5,15.15 42.5,15.75 41,17.25 41,19.25 41.58,19.83 42.92,19.83 49.75,13 49.75,11 47.75,9 v47.25,9 | TP5.TP 23.95,23.4 R19.1
  Top 0.203: R40.2 R39.2 45.95,8.95 v46,9
  Top 0.305: R20.2 R40.2
  Bottom 0.152: v25.22,29.25 25.22,28 v25.25,27.97
  Bottom 0.2: v46,9 v47.25,9
LTC_VCC
  Top 0.2: TP3.TP 26.35,10.25 R9.1 24.85,10.95 24,11.8 24,13.94 24.2,14.14 24.2,17.8 23.4,18.6 23.4,19.55 23.5,19.65
  Top 0.305: 19.21,20.18 C8.1 | 23.15,20 R14.1 23.5,19.65 23.5,20.5 22.75,21.25 19.75,21.25 19.4,20.9 C8.1 | C8.1 19.3,20.15 C1.2 20.18,17.38 U2.7
N$1
  Top 0.203: U2.2 U2.1
  Top 0.305: U2.1 18,11.81 | 18,11.81 17.67,11.81 | 18,11.81 17.09,11.81 R8.2
N$2
  Top 0.305: 19.45,16.52 U2.8 19.48,16.25 19,16.25 18.25,17 18.25,17.25 18.25,20.55 R6.2
N$3
  Bottom 0.305: R27.1 12,10.25 USB_LED.C
N$5
  Top 0.305: U2.3 20.75,11.8 20.75,11 21.46,10.29 23.11,10.29 R9.2
N$6
  Top 0.305: U2.6 20.82,17.88 C1.1
N$7
  Top 0.2: C4.2 33.94,22.75 33.96,22.77 34.4,22.85 35,22.25 35,19.3 U1.5 35.8,16.97 R7.1
N$8
  Top 0.2: R2.1 C5.2 37.85,12.34 38.35,12.85 38.35,14.15 37.7,14.81 R7.2
N$9
  Top 0.2: L3.2 26.76,16.75 25.7,17.8 25,18.5 25,19.65 R14.2
N$10
  Bottom 0.2: U4.1 42.5,12.23 U$2.1 D1.A
N$11
  Top 0.2: R3.2 31.25,11.5 32.74,12.99 | 32.74,12.99 33,13.25 33,14.38 U1.2 | 32.74,12.99 33.85,11.88 C6.2 R12.1
N$12
  Top 0.2: R13.2 27.26,22.49 28,21.75 28,19.65 L2.2
N$13
  Top 0.2: C15.1 40.66,9.85 U5.10 43.56,11.75 43.85,12.04 43.85,14.02 43.45,14.36 43.45,16.4 R21.2
N$14
  Bottom 0.2: U3.4 32.45,15.55 C19.2
N$15
  Bottom 0.2: U3.5 34.05,11.8 R4.2
N$17
  Bottom 0.2: R15.1 41.35,12.6 42,13.25 42,14.9 | 42,14.9 R16.1 | 42,14.9 42.61,14.9 U4.3
N$18
  Bottom 0.2: U4.4 45.44,15.44 46.25,16.25 47.4,16.25 R17.1
N$19
  Bottom 0.2: C17.2 R18.2
N$20
  Top 0.305: R19.2 26.2,21.65 L5.2
N$21
  Top 0.2: 40.63,12.25 U5.9 | 40.63,12.25 C15.2 | R22.2 39.98,12.9 40.63,12.25
N$22
  Bottom 0.2: R28.1 23.81,11.86 5V_LED.C
N$23
  Bottom 0.2: VCALIB_LED.C 11.75,25.5 12.08,25.17 12.1,25.17 12.15,25.1 12.25,25 12.25,24.95 13.18,23.62 15.87,23.62 16,23.75 16,24.4 R29.1
N$24
  Bottom 0.2: VMCU_LED.C 10.34,25.5 10.99,24.85 11.89,24.85 13.04,23.2 16.7,23.2 16.85,23.84 16.85,25.3 R30.1
N$25
  Top 0.254: VCALIB_LED1.C R31.1
N$26
  Top 0.254: VMCU_LED1.C R32.1
N$30
  Bottom 0.2: R23.1 18.17,25.33 20.75,22.75 25.5,22.75 26.05,23.3 U6.1
N$31
  Bottom 0.2: U6.3 27.43,24.53 26.52,24.53 26.38,24.38 25.25,23.25 21,23.25 20.2,24.05 R24.1
N$32
  Bottom 0.2: U6.8 34.68,27.32 35,27 35,26 35.75,25.25 36.1,25.25 R25.1
N$33
  Bottom 0.2: U6.11 34.75,25.25 35.75,24.25 38.6,24.25 R26.1
S1_OUT
  Top 0.2: 22.4,11.8 23.1,12.5 23.1,13.27 23.15,13.32 | 22.4,11.8 U2.4 | 22.4,11.8 22.4,11.4 22.6,11.2 23.8,11.2 24,11 24,9.4 24.4,9 24.4,6 24.41,5.99 29.05,1.75 TP1.TP
  Top 0.305: R11.2 C2.1 23.15,14.5 23.15,13.32 R10.2
S1_OUT_F
  Top 0.2: 27.6,14.68 27.68,14.65 | C3.1 27.6,14.68 | U1.3 33.43,14.66 33.43,15.47 33.28,15.62 32,15.62 31.98,15.6 31.95,15.6 31,14.64 31,13.5 30.5,13 28.75,13 27.4,14.35 C3.1 | 27.39,14.96 C3.1 | R11.1 25.1,16.15 25.5,15.75 26.46,15.75 26.49,15.72 26.56,15.72 27.6,14.68
  Top 0.305: 25.2,17.15 R11.1
S2_OUT
  Top 0.2: R12.2 31.4,9 R1.2 30.5,9.1 30.5,10 29.75,10.75 29.75,12.06 30,12.3 30.3,12.3 32.27,14.28 U1.1 | R12.2 C6.1 | 34.25,7.25 34.45,7.45 35.51,8.5 R2.2 | 34.25,7.25 33.15,7.25 R12.2 | TP2.TP 36.4,4.5 34.25,7.25
SCL
  Top 0.2: U5.5 45.03,13.78 44.25,13 44.25,11 43.25,10 42.5,10 41.75,9.25 41.75,7.25 42.25,6.75 42.82,6.75 42.9,6.67 | 42.9,6.67 R40.1 | 42.9,6.67 42.9,3.92 JP4.2
SDA
  Top 0.2: U5.4 45.28,13.28 44.75,12.75 44.75,10.6 | 43.75,7.9 43.75,6 45.25,4.5 45.25,3.77 JP4.3
  Top 0.203: 43.75,7.9 43.75,8.1 43,8.85 | 43,8.85 R39.1 | 44.75,10.6 44.74,10.6 43,8.85
SHUNT_V+
  Top 0.152: 14.4,21.65 14.4,24.65 18.25,28.5 30.5,28.5 40.25,18.75 40.25,18.1 R21.1
  Top 0.2: U5.8 42.5,12.86 41.11,12.86 40.44,13.77 40.44,16.81 40.25,17 40.25,17.9 R21.1 | 16.35,15.48 16.46,15.59 17,16.13 17,17 16.25,17.75 15,17.75 14.4,18.35 14.4,21.65 | R8.1 15.25,13.85 TP10.TP
  Top 0.305: 16.39,14.79 16.35,15.48 U$1.I1 | R8.1 16.75,15.3 16.46,15.59
SHUNT_V-
  Top 0.152: R6.1 16.23,21 17,21.78 22.75,21.78 23.36,22.38 25.41,22.38 26.55,23.53 34.47,23.53 39,19 39,17 39.5,16.5 R22.1
  Top 0.2: R6.1 15.9,19.51 15.98,19.43 | TP11.TP 14.8,12 15.8,13 17.4,13 18.2,13.8 18.2,16.2 17.6,16.8 17.6,17.71 U$1.I2
  Top 0.305: 15.98,19.43 U$1.I2
SW_CTRL_0
  Bottom 0.2: U10.6 9.24,20.64 9.24,22.51 7.8,23.95 R33.2 7.27,24.22 JP1.1
SW_CTRL_1  (via drill 0.3)
  Top 0.2: v44,21.5 47.94,21.5 JP3.1
  Bottom 0.2: U6.13 34.43,24.07 36.22,22.28 38.97,22.28 40.5,20.75 43.25,20.75 v44,21.5 43.94,21.56 R34.2
SW_CTRL_2  (via drill 0.3)
  Top 0.2: v32.06,28.22 43.76,28.22 JP3.2
  Bottom 0.2: v32.06,28.22 32.03,28.25 31.75,28.25 29.5,26 27.64,26 U6.5 26.65,25.9 25.05,24.3 R35.2
SW_CTRL_3  (via drill 0.3)
  Top 0.2: v31.49,28.78 45.74,28.78 JP3.3
  Bottom 0.2: v31.49,28.78 31.5,28.77 31.5,28.75 29.3,26.55 U6.6 26.61,26.55 25.36,25.3 22.9,25.3 22.69,25.09 | R36.2 22.45,24.85 22.69,25.09 | 22.69,25.09 22.8,25.2
SW_CTRL_4  (via drill 0.3)
  Top 0.2: JP3.4 48.81,28.25 50,28.25 51,27.25 51,22.5 50.56,22.06 41.56,22.06 v41,21.5
  Bottom 0.2: 41,23.1 v41,21.5 | 41,23.1 R37.2 | U6.12 34.65,24.6 36.25,23 40.9,23 41,23.1
SW_CTRL_PWR  (via drill 0.3)
  Top 0.2: 6.28,17.59 U7.1
  Top 0.305: U7.1 5.15,17.65 v5,17.5
  Bottom 0.2: 5,24.06 R38.2 | v5,17.5 8.75,21.25 8.75,22.25 8,23 5.5,23 4.75,23.75 R38.2 | JP1.2 4.73,23.97 R38.2
V_CALIB
  Bottom 0.2: 29,24 29.25,23.75 29.25,23 28.5,22.25 12,22.25 11.7,22.45 U10.3 11.7,23.8 VCALIB_LED.A | 28.25,24 29,24 | 29,24 29.25,24.25 29.25,25.25 | 29.25,25.25 U6.4 | U6.2 28.95,23.95 29,24 | 29.25,25.25 30.5,25.25 31.54,26.29 | 31.54,26.29 31.8,26.55 U6.9 | U6.10 31.94,25.9 31.54,26.29
V_EXT
  Top 0.305: VMCU_LED1.A 8.5,21 8.5,17.87 8.34,17.71 U7.6
  Top 0.406: JP6.3 4.49,6.38 4.02,6.38 3.22,7.18 3.22,17.97 3.5,18.25 7.8,18.25 8.34,17.71
VIN
  Top 0.2: TP6.TP 9.6,15.85 9.94,16.19 | 9.94,16.19 10,16.25 | 10.05,16.2 9.95,16.2 9.94,16.19
  Top 0.305: 11.96,15.54 U$1.E1 12.12,15.5 10.75,15.5 10.05,16.2 | U7.5 9.25,17 10,16.25
VMCU  (via drill 0.3)
  Top 0.305: X1.1 18.82,7.39 18.82,4.82 15.75,1.75 3.25,1.75 2.5,2.5 2.5,23.25 3,23.75 8.5,23.75 v8.75,24 8.75,26.27 JP5.1
  Bottom 0.2: U10.1 9.8,23.95 VMCU_LED.A v8.75,24
VOUT  (via drill 0.3)
  Top 0.305: U$1.E2 12.2,19.7 v13,20.5
  Bottom 0.305: v13,20.5 12.12,20.5 U10.4

### Text on the board
tNames: SW | PWR | SW0 | VMCU | GND | SW4 | SW3 | SW2 | SW1 | S_V+ | S_V- | S2OUT | S1OUT | ADC | SCL | SDA | ALT | GND | V_EXT | GND | 5V